# Altium schematic sheet ProjectNote1.SchDoc
size 241 x 381 mm; SheetNumber: 1; SheetTotal: 6
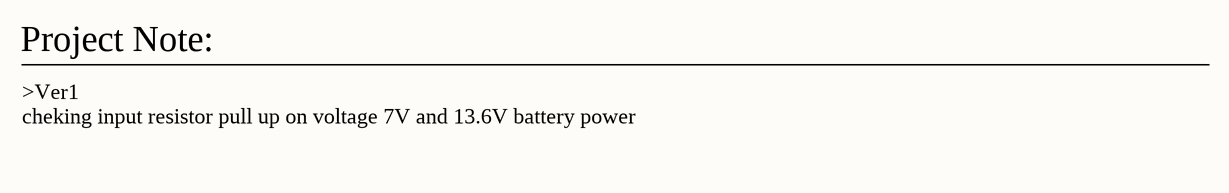
[diagram p0: ProjectNote1.SchDoc]

## Notes on the sheet
- Project Note:
- >Ver1
  cheking input resistor pull up on voltage 7V and 13.6V battery power
- Note: